# Altium schematic sheet VFan.SchDoc
size A4
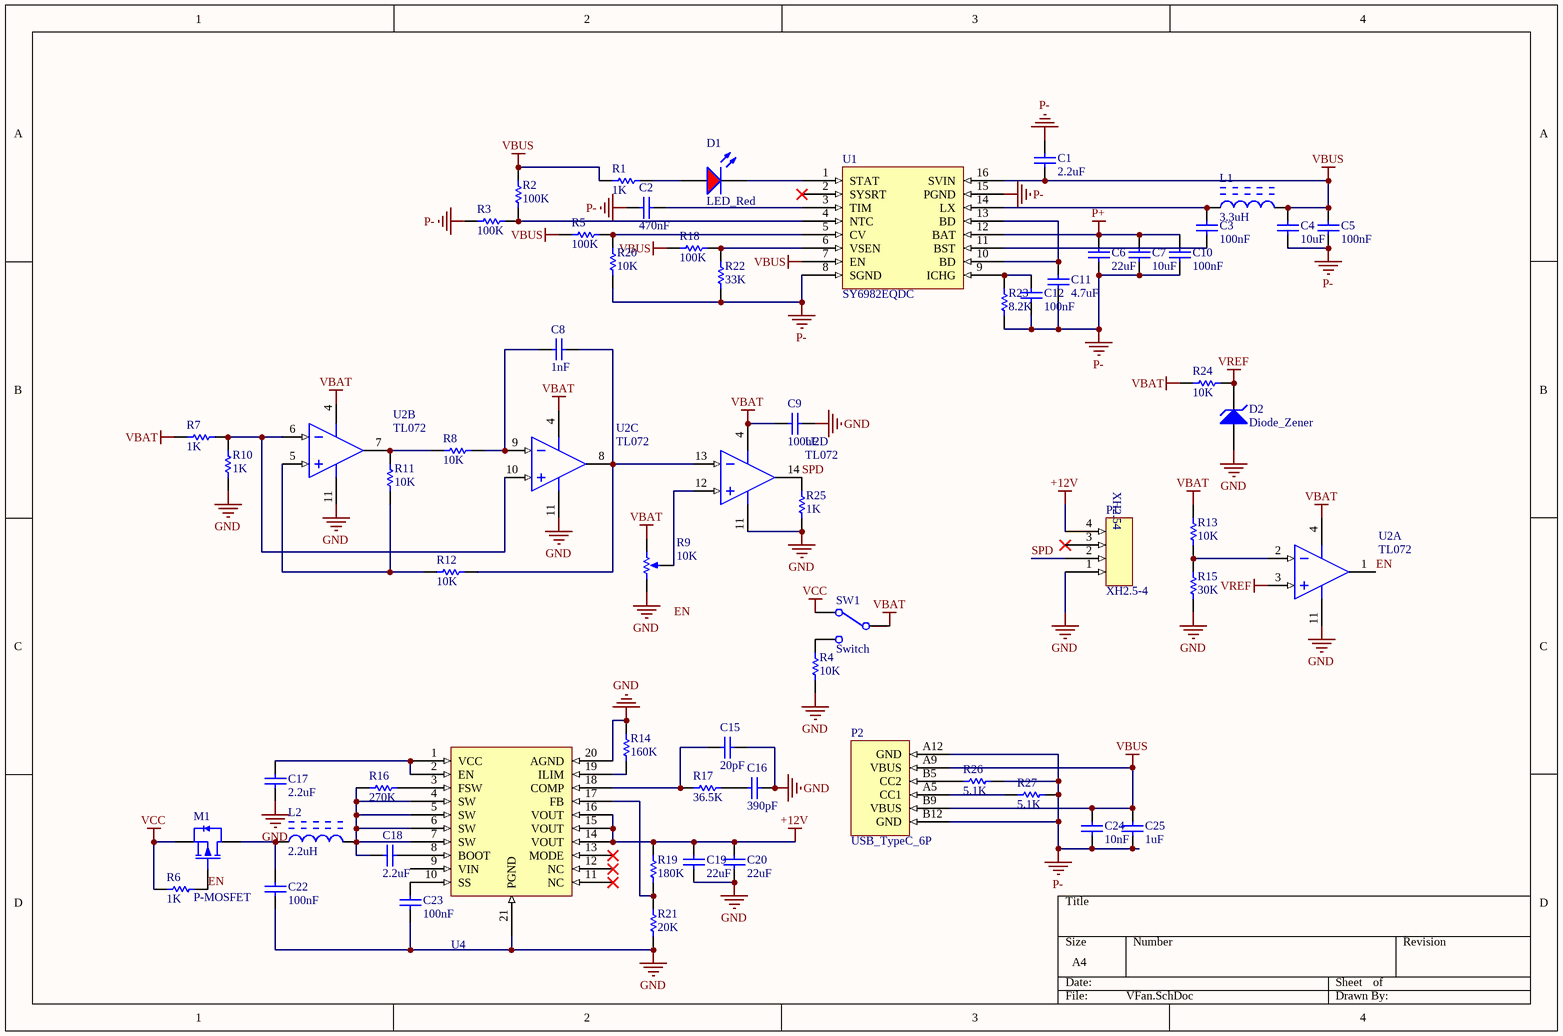
[diagram p0: VFan.SchDoc]

## Parts
C1  2.2uF  [SMC_0805]
C2  470nF  [SMC_0402]
C3  100nF  [SMC_0402]
C4  10uF  [SMC_0805]
C5  100nF  [SMC_0603]
C6  22uF  [SMC_0805]
C7  10uF  [SMC_0805]
C8  1nF  [SMC_0402]
C9  100nF  [SMC_0402]
C10  100nF  [SMC_0603]
C11  4.7uF  [SMC_0805]
C12  100nF  [SMC_0603]
C15  20pF  [SMC_0402]
C16  390pF  [SMC_0402]
C17  2.2uF  [SMC_0603]
C18  2.2uF  [SMC_0603]
C19  22uF  [SMC_1210]
C20  22uF  [SMC_1210]
C22  100nF  [SMC_0402]
C23  100nF  [SMC_0402]
C24  10nF  [SMC_0402]
C25  1uF  [SMC_0402]
D1  LED_Red  [THLED_3mm]
D2  Diode_Zener  [SOD-123]
L1  3.3uH  [SML_4.1x4.6]
L2  2.2uH  [SML_7.4x6.6]
M1  P-MOSFET  [SOIC127P600X175-8N]
P1  XH2.5-4  [XH2.54-4S]
P2  USB_TypeC_6P  [USB_TypeC_6P]
R1  1K  [SMR_0402]
R2  100K  [SMR_0402]
R3  100K  [SMR_0402]
R4  10K  [SMR_0402]
R5  100K  [SMR_0402]
R6  1K  [SMR_0402]
R7  1K  [SMR_0402]
R8  10K  [SMR_0402]
R9  10K  [RV09032]
R10  1K  [SMR_0402]
R11  10K  [SMR_0402]
R12  10K  [SMR_0402]
R13  10K  [SMR_0402]
R14  160K  [SMR_0402]
R15  30K  [SMR_0402]
R16  270K  [SMR_0402]
R17  36.5K  [SMR_0402]
R18  100K  [SMR_0402]
R19  180K  [SMR_0402]
R20  10K  [SMR_0402]
R21  20K  [SMR_0402]
R22  33K  [SMR_0402]
R23  8.2K  [SMR_0402]
R24  10K  [SMR_0402]
R25  1K  [SMR_0402]
R26  5.1K  [SMR_0402]
R27  5.1K  [SMR_0402]
SW1  Switch  [Switch]
U1  SY6982EQDC  [SY6982EQDC]
U2  TL072  [TSOP65P640X120-14N]  (parts A,B,C,D of 4)
U4  Buck Boost Converter  [QFN50P350X450X100_HS-21N]  (value not drawn)

## Nets
+12V: C19.2 C20.2 P1.4 R19.2 U4.14(VOUT) U4.15(VOUT) U4.16(VOUT)
GND: C9.2 C15.2 C16.2 C17.1 C19.1 C20.1 C22.2 C23.2 D2.A P1.1 R4.1 R9.1(TOP) R10.1 R14.2 R15.1 R21.1 R25.2 U2.11(V-) U4.20(AGND) U4.21(PGND)
P+: C6.2 C7.2 C10.2 U1.12(BAT)
P-: C1.2 C2.1 C4.1 C5.1 C6.1 C7.1 C10.1 C11.1 C12.1 C24.1 C25.1 P2.A12(GND) P2.B12(GND) R3.1 R20.1 R22.1 R23.1 R26.2 R27.2 U1.8(SGND) U1.15(PGND)
VBAT: C9.1 R7.2 R9.3(BOT) R13.2 R24.2 SW1.1 U2.4(V+)
VBUS: C1.1 C4.2 C5.2 C24.2 C25.2 L1.2 P2.A9(VBUS) P2.B9(VBUS) R1.2 R2.2 R5.2 R18.2 U1.7(EN) U1.16(SVIN)
VCC: M1.S R6.2 SW1.2
VREF: D2.K R24.1 U2.3(IN+)
EN: M1.G R6.1 U2.1(OUT)
SPD: P1.2 R25.1 U2.14(OUT)
NetC2_2: C2.2 U1.3(TIM)
NetC3_1: C3.1 U1.11(BST)
NetC3_2: C3.2 L1.1 U1.14(LX)
NetC8_1: C8.1 R8.2 U2.9(IN-)
NetC8_2: C8.2 R12.2 U2.8(OUT) U2.13(IN-)
NetC11_2: C11.2 U1.10(BD) U1.13(BD)
NetC12_2: C12.2 R23.2 U1.9(ICHG)
NetC15_1: C15.1 R17.2 U4.18(COMP)
NetC16_1: C16.1 R17.1
NetC17_2: C17.2 U4.1(VCC) U4.2(EN)
NetC18_1: C18.1 U4.8(BOOT)
NetC18_2: C18.2 L2.2 R16.1 U4.4(SW) U4.5(SW) U4.6(SW) U4.7(SW)
NetC22_1: C22.1 L2.1 M1.D
NetC23_1: C23.1 U4.10(SS)
NetD1_A: D1.A R1.1
NetD1_K: D1.K U1.1(STAT)
NetP2_A5: P2.A5(CC1) R27.1
NetP2_B5: P2.B5(CC2) R26.1
NetR2_1: R2.1 R3.2 U1.4(NTC)
NetR4_2: R4.2 SW1.3
NetR5_1: R5.1 R20.2 U1.5(CV)
NetR7_1: R7.1 R10.2 U2.6(IN-) U2.10(IN+)
NetR8_1: R8.1 R11.2 U2.7(OUT)
NetR9_2: R9.2(TAP) U2.12(IN+)
NetR11_1: R11.1 R12.1 U2.5(IN+)
NetR13_1: R13.1 R15.2 U2.2(IN-)
NetR14_1: R14.1 U4.19(ILIM)
NetR16_2: R16.2 U4.3(FSW)
NetR18_1: R18.1 R22.2 U1.6(VSEN)
NetR19_1: R19.1 R21.2 U4.17(FB)

Not connected (* = marked no-connect by the designer): P1 3*; U1 2(SYSRT)*; U4 9(VIN) 11(NC)* 12(NC)* 13(MODE)*

## Notes on the sheet
- Labels drawn without touching a wire or pin: EN, VBAT
- (in symbol XH2.5-4) XH2.54

## Library data of the parts
C1-C12 C15-C20 C22-C25 = Cap Ceramic
L1 L2 = Inductor_Ferrite SMT
R1-R8 R10-R27 = Res SMT
R9 = Res Var
U2 = OPA4376
U4 = TPS61088